# EAGLE design Rapid_Feeder_Master_RS485_small_v2 (EAGLE 9.6.2)
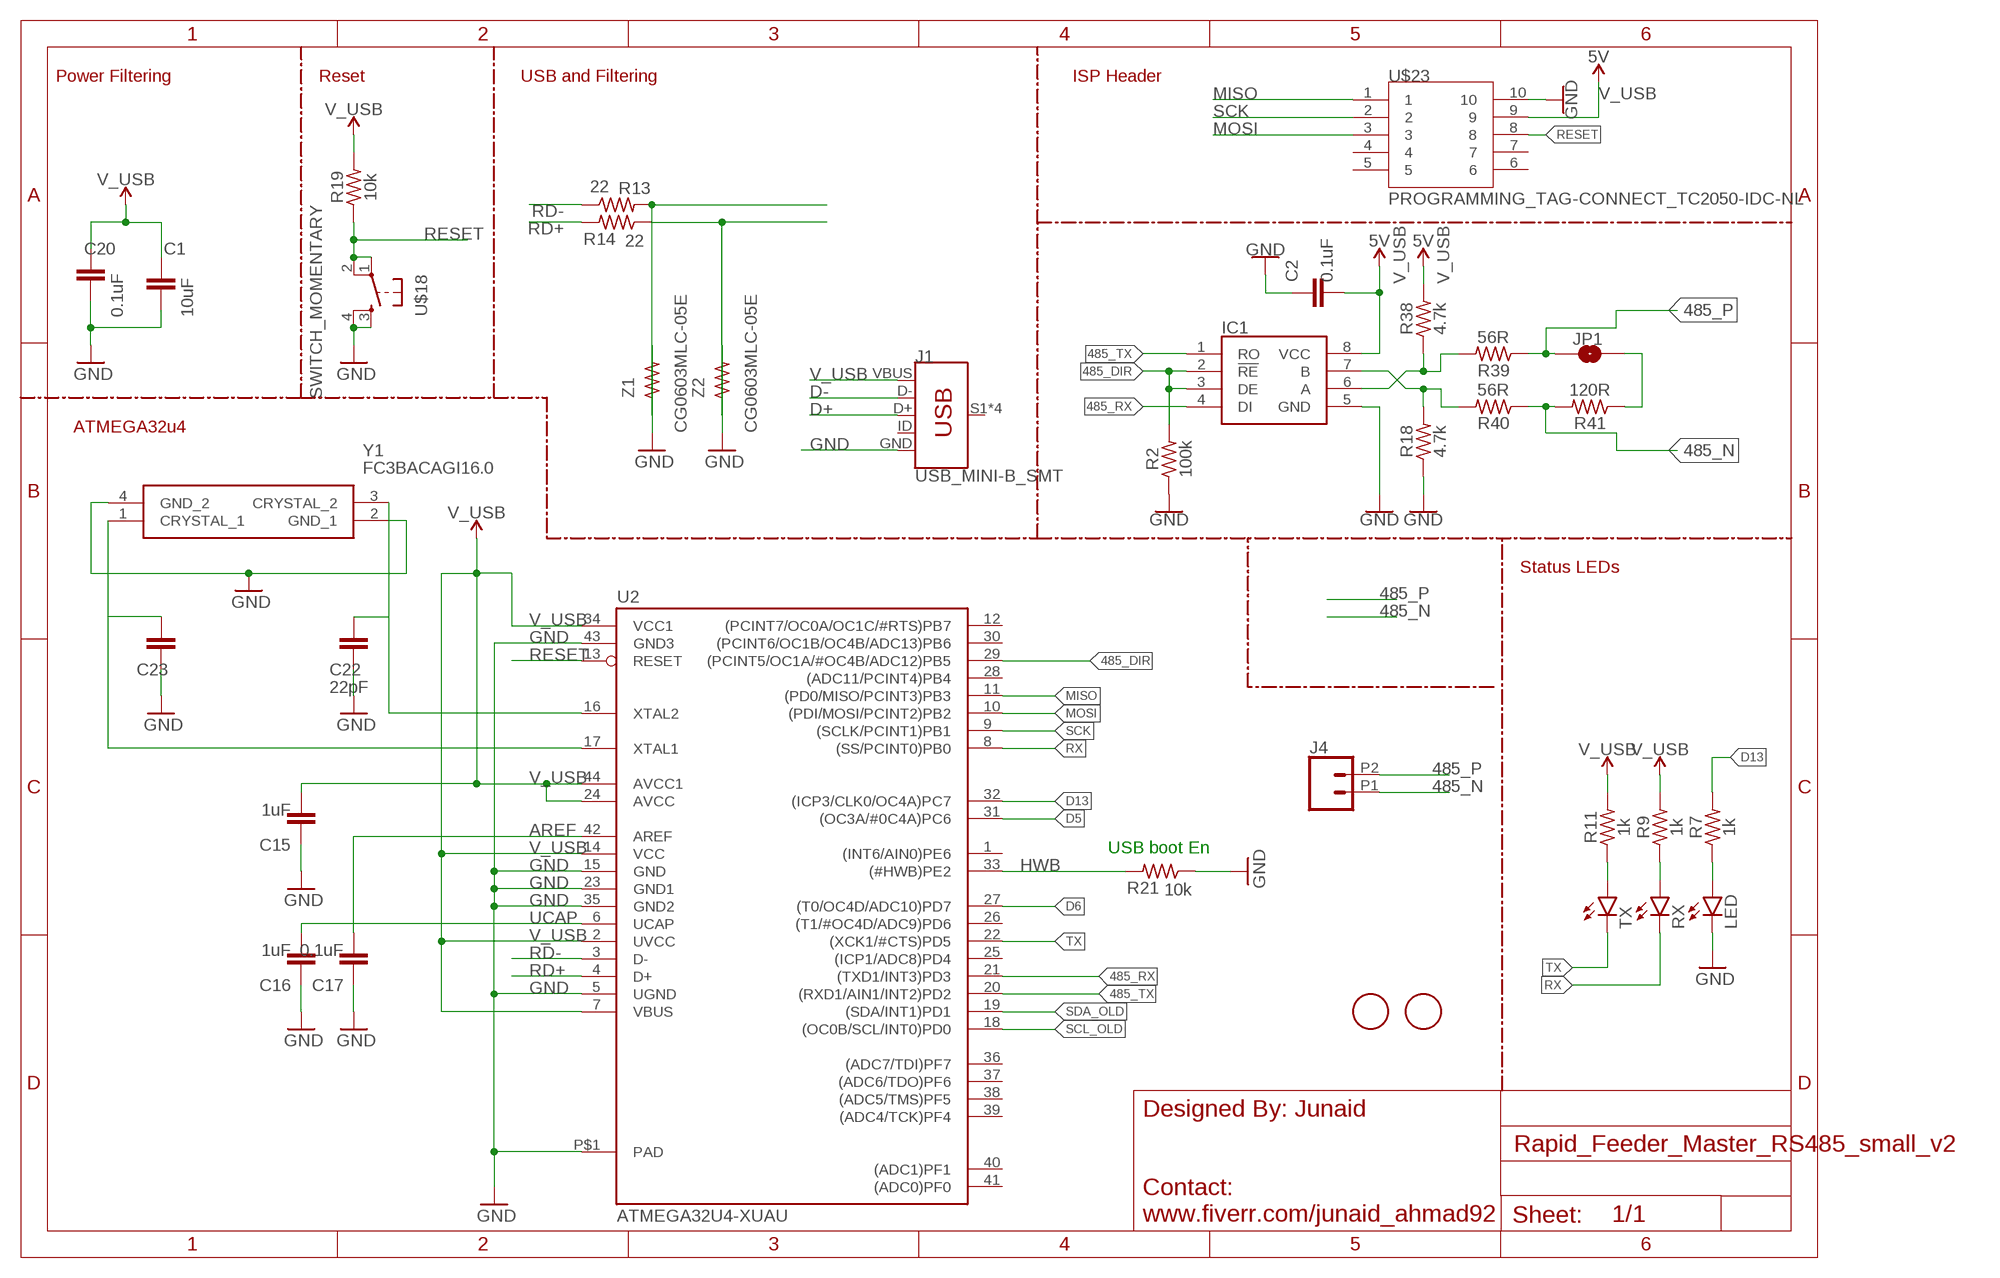
[diagram p0: schematic, sheet 1]

## Parts
C1  10uF  CAPACITORSC0805  [C0805]
C2  0.1uF  CAP_0603  [CAP_0603]
C15  1uF  CAP_0603  [CAP_0603]
C16  1uF  CAP_0603  [CAP_0603]
C17  0.1uF  CAP_0603  [CAP_0603]
C20  0.1uF  CAP_0603  [CAP_0603]
C22  22pF  CAP_0603  [CAP_0603]
C23  22pF  CAP_0603  [CAP_0603]
IC1  ADM4850ARZ-REEL7  [SOIC127P600X175-8N]
J1  USB_MINI-B_SMT  [USB-MINIB]
J4  CONN_022.54MM_SCREWTERM  [1X02_2.54_SCREWTERM]
JP1  JUMPER-SMT_2_NO_NO-SILK  [SMT-JUMPER_2_NO_NO-SILK]
LED  LED0603  [LED-0603]
R2  100k  RESISTOR_0603  [RESISTOR_0603]
R7  1k  RESISTOR_0603  [RESISTOR_0603]
R9  1k  RESISTOR_0603  [RESISTOR_0603]
R11  1k  RESISTOR_0603  [RESISTOR_0603]
R13  22  RESISTOR_0603  [RESISTOR_0603]
R14  22  RESISTOR_0603  [RESISTOR_0603]
R18  4.7k  RESISTOR_0603  [RESISTOR_0603]
R19  10k  RESISTOR_0603  [RESISTOR_0603]
R21  10k  RESISTOR_0603  [RESISTOR_0603]
R38  4.7k  RESISTOR_0603  [RESISTOR_0603]
R39  56R  RESISTOR_0603  [RESISTOR_0603]
R40  56R  RESISTOR_0603  [RESISTOR_0603]
R41  120R  RESISTOR_0603  [RESISTOR_0603]
RX  LED0603  [LED-0603]
TX  LED0603  [LED-0603]
U2  ATMEGA32U4-XUAU  [TQFP44-PAD]
U$1  FIDUCIAL  [FIDUCIAL_1MM]
U$2  FIDUCIAL  [FIDUCIAL_1MM]
U$18  SWITCH_MOMENTARY  [SWITCH_MOMENTARY]
U$23  PROGRAMMING_TAG-CONNECT_TC2050-IDC-NL  [PROGRAMMING_TAG-CONNECT_TC2050-IDC-NL]
Y1  FC3BACAGI16.0  [FC3BACAGI160]
Z1  CG0603MLC-05E  RESISTOR_0603  [RESISTOR_0603]
Z2  CG0603MLC-05E  RESISTOR_0603  [RESISTOR_0603]

## Nets
485_DIR: IC1.2(!RE) IC1.3(DE) R2.2 U2.29((PCINT5/OC1A/#OC4B/ADC12)PB5)
485_N: J4.P1 R40.1 R41.2
485_P: J4.P2 JP1.1 R39.1
485_RX: IC1.4(DI) U2.21((TXD1/INT3)PD3)
485_TX: IC1.1(RO) U2.20((RXD1/AIN1/INT2)PD2)
AREF [aref]: C17.2 U2.42(AREF)
D5: U2.31((OC3A/#0C4A)PC6)
D6: U2.27((T0/OC4D/ADC10)PD7)
D13: R7.2 U2.32((ICP3/CLK0/OC4A)PC7)
D+ [diff pairs]: J1.D+ R14.1 Z2.1
D- [diff pairs]: J1.D- R13.2 Z1.1
GND: C1.1 C2.1 C15.1 C16.1 C17.1 C20.1 C22.2 C23.2 IC1.5(GND) J1.GND LED.C R2.1 R18.1 R21.1 U2.5(UGND) U2.15(GND) U2.23(GND1) U2.35(GND2) U2.43(GND3) U2.P$1(PAD) U$18.3 U$18.4 U$23.10 Y1.2(GND_1) Y1.4(GND_2) Z1.2 Z2.2
HWB: R21.2 U2.33((#HWB)PE2)
MISO: U2.11((PD0/MISO/PCINT3)PB3) U$23.1
MOSI: U2.10((PDI/MOSI/PCINT2)PB2) U$23.3
N$10: R11.1 TX.A
N$18: IC1.6(A) R38.1 R39.2
N$19: IC1.7(B) R18.2 R40.2
N$20: JP1.2 R41.1
N$22: R9.1 RX.A
N$23: LED.A R7.1
RD+: R14.2 U2.4(D+)
RD-: R13.1 U2.3(D-)
RESET: R19.1 U2.13(RESET) U$18.1 U$18.2 U$23.8
RX: RX.C U2.8((SS/PCINT0)PB0)
SCK: U2.9((SCLK/PCINT1)PB1) U$23.2
SCL_OLD: U2.18((OC0B/SCL/INT0)PD0)
SDA_OLD: U2.19((SDA/INT1)PD1)
TX: TX.C U2.22((XCK1/#CTS)PD5)
UCAP: C16.2 U2.6(UCAP)
V_USB: C1.2 C2.2 C15.2 C20.2 IC1.8(VCC) J1.VBUS R9.2 R11.2 R19.2 R38.2 U2.2(UVCC) U2.7(VBUS) U2.14(VCC) U2.24(AVCC) U2.34(VCC1) U2.44(AVCC1) U$23.9 ; supply symbol labelled 5V
XTAL3: C22.1 U2.16(XTAL2) Y1.3(CRYSTAL_2)
XTAL4: C23.1 U2.17(XTAL1) Y1.1(CRYSTAL_1)
Unconnected: J1.ID J1.S1(SHIELD) J1.S2(SHIELD) J1.S3(SHIELD) J1.S4(SHIELD) U2.1((INT6/AIN0)PE6) U2.12((PCINT7/OC0A/OC1C/#RTS)PB7) U2.25((ICP1/ADC8)PD4) U2.26((T1/#OC4D/ADC9)PD6) U2.28((ADC11/PCINT4)PB4) U2.30((PCINT6/OC1B/OC4B/ADC13)PB6) U2.36((ADC7/TDI)PF7) U2.37((ADC6/TDO)PF6) U2.38((ADC5/TMS)PF5) U2.39((ADC4/TCK)PF4) U2.40((ADC1)PF1) U2.41((ADC0)PF0) U$23.4 U$23.5 U$23.6 U$23.7

## Notes on the sheet
- Power Filtering | Reset | USB and Filtering | ISP Header
- ATMEGA32u4
- Status LEDs
- USB boot En

## Library data of the parts
C1 = My-custom-components:CAPACITORS
C2 C15-C17 C20 C22 C23 = Shai-Parts:CAP_0603
IC1 = ADM4850ARZ-REEL7:ADM4850ARZ-REEL7: RS-422/RS-485 Interface IC 5V Slew-Rate Ltd Half Duplex 115kbps Source: Datasheet <https://www.analog.com/media/en/technical-documentation/data-sheets/ADM4850_4851_4852_4853_4854_4855_4856_4857.pdf>; DESCRIPTION: RS-422/RS-485 Interface IC 5V Slew-Rate Ltd Half Duplex 115kbps; HEIGHT: 1.75mm; MANUFACTURER_NAME: Analog Devices; MANUFACTURER_PART_NUMBER: ADM4850ARZ-REEL7; MOUSER_PART_NUMBER: 584-ADM4850ARZ-R7; MOUSER_PRICE-STOCK: https://www.mouser.com/Search/Refine.aspx?Keyword=584-ADM4850ARZ-R7
J1 = SparkFun-Connectors:USB_MINI-B: USB type Mini-B Connector Breaks out 5th pin, and includes shield pins if needed. SparkFun Products: SparkFun FTDI Basic Breakout <https://www.sparkfun.com/products/9716> SparkFun XBee Explorer USB <https://www.sparkfun.com/products/11812> SparkFun Redboard <https://www.sparkfun.com/products/12757>; PROD_ID: CONN-08193; SF_ID: PRT-00587
J4 = SparkFun-Connectors:CONN_02: Multi connection point. Often used as Generic Header-pin footprint for 0.1 inch spaced/style header connections On any of the 0.1 inch spaced packages, you can populate with these: Break Away Headers - Straight <https://www.sparkfun.com/products/116> (PRT-00116) Break Away Male Headers - Right Angle <https://www.sparkfun.com/products/553> (PRT-00553) Female Headers <https://www.sparkfun.com/products/115> (PRT-00115) Break Away Headers - Machine Pin <https://www.sparkfun.com/products/117> (PRT-00117) Break Away Female Headers - Swiss Machine Pin <https://www.sparkfun.com/products/743> (PRT-00743) For SCREWTERMINALS and SPRING TERMINALS visit here: Screw Terimnals on SparkFun.com <https://www.sparkfun.com/search/results?term=Screw+Terminals> (5mm/3.5mm/2.54mm spacing) This device is also useful as a general connection point to wire up your design to another part of your project. Our various solder wires solder well into these plated through hole pads. Hook-Up Wire - Assortment (Stranded, 22 AWG) <https://www.sparkfun.com/products/11375> (PRT-11375) Hook-Up Wire - Assortment (Solid Core, 22 AWG) <https://www.sparkfun.com/products/11367> (PRT-11367) View the entire wire category on our website here <https://www.sparkfun.com/categories/141> Special notes: Molex polarized connector foot print use with: PRT-08233 with associated crimp pins and housings. 2.54_SCREWTERM for use with PRT-10571. 3.5mm Screw Terminal footprints for PRT-08084 5mm Screw Terminal footprints for use with PRT-08432
JP1 = SparkFun-Jumpers:JUMPER-SMT_2_NO: Normally open jumper This jumper has two pads in close proximity to each other. Apply solder to close the connection. Round pads are easier to solder for beginners, but are a lot larger. SparkFun Product that uses the round pads: SparkFun EL Sequencer <https://www.sparkfun.com/products/12781>
LED RX TX = SparkFun-LED:LED: LED (Generic) Standard schematic elements and footprints for 5mm, 3mm, 1206, and 0603 sized LEDs. Generic LEDs with no color specified.
R2 R7 R9 R11 R13 R14 R18 R19 R21 R38-R41 Z1 Z2 = Shai-Parts:RESISTOR_0603
U2 = SmartPrj:ATMEGA32U4-XU
U$1 U$2 = adafruit:FIDUCIAL: For use by pick and place machines to calibrate the vision/machine, 1mm By microbuilder.eu
U$18 = Shai-Parts:SWITCH_MOMENTARY
U$23 = Shai-Parts:PROGRAMMING_TAG-CONNECT_TC2050-IDC-NL
Y1 = samacsys:FC3BACAGI16.0: Crystals 16MHz 12pF 30ppm -40C +125C Source: Datasheet <https://www.foxonline.com/wp-content/uploads/pdfs/C3BA.pdf>; ARROW_PART_NUMBER: FC3BACAGI16.0; DESCRIPTION: Crystals 16MHz 12pF 30ppm -40C +125C; HEIGHT: 0.8mm; MANUFACTURER_NAME: Fox; MANUFACTURER_PART_NUMBER: FC3BACAGI16.0; MOUSER_PART_NUMBER: 559-FC3BACAGI16.0; MOUSER_PRICE-STOCK: https://www.mouser.co.uk/ProductDetail/Fox/FC3BACAGI160?qs=W0yvOO0ixfHpyQil83gR7Q%3D%3D

## Net classes
1 diff pairs: width 0.203 mm, drill 0.35 mm, clearance 0.203 mm
4 aref: width 0.254 mm, drill 0.499 mm, clearance 0.254 mm

## Board
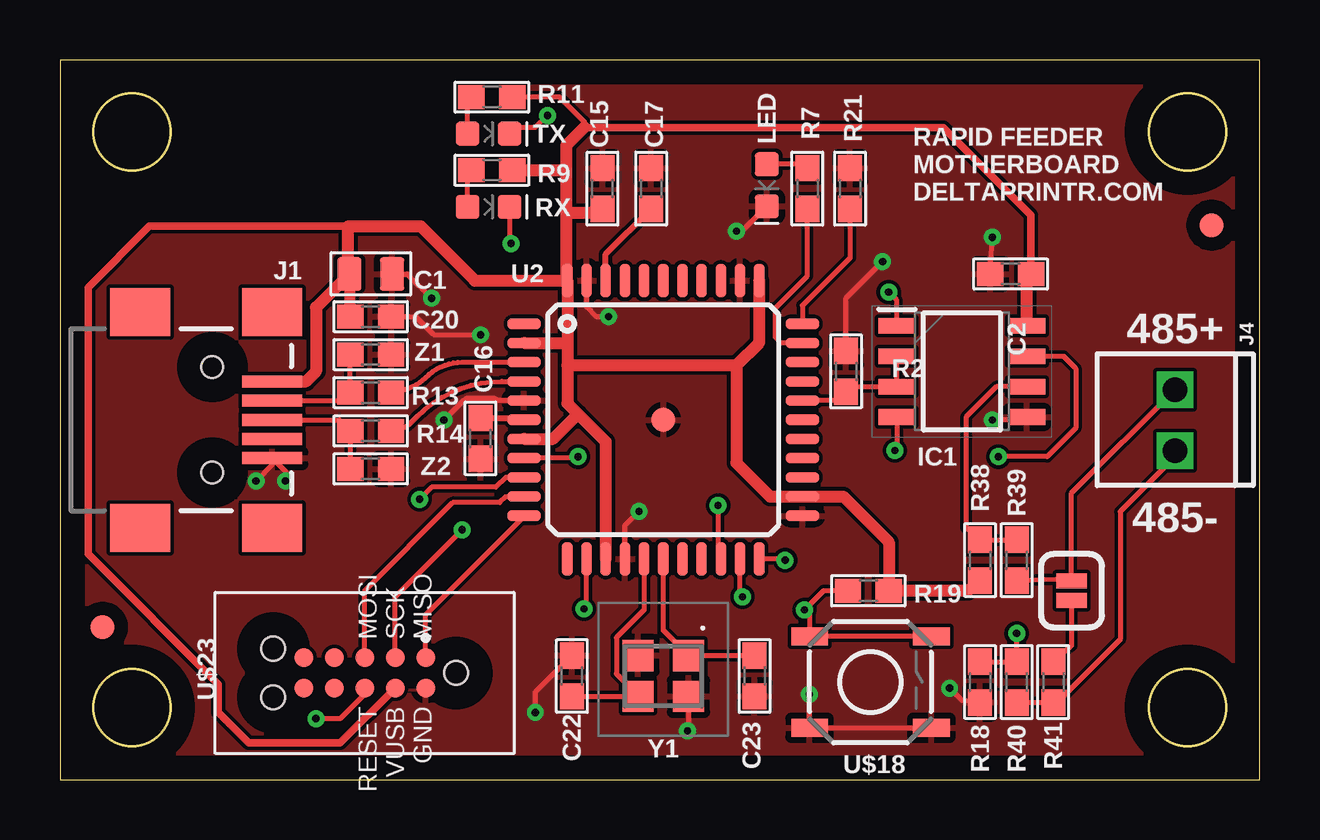
[diagram p1: board, top side]
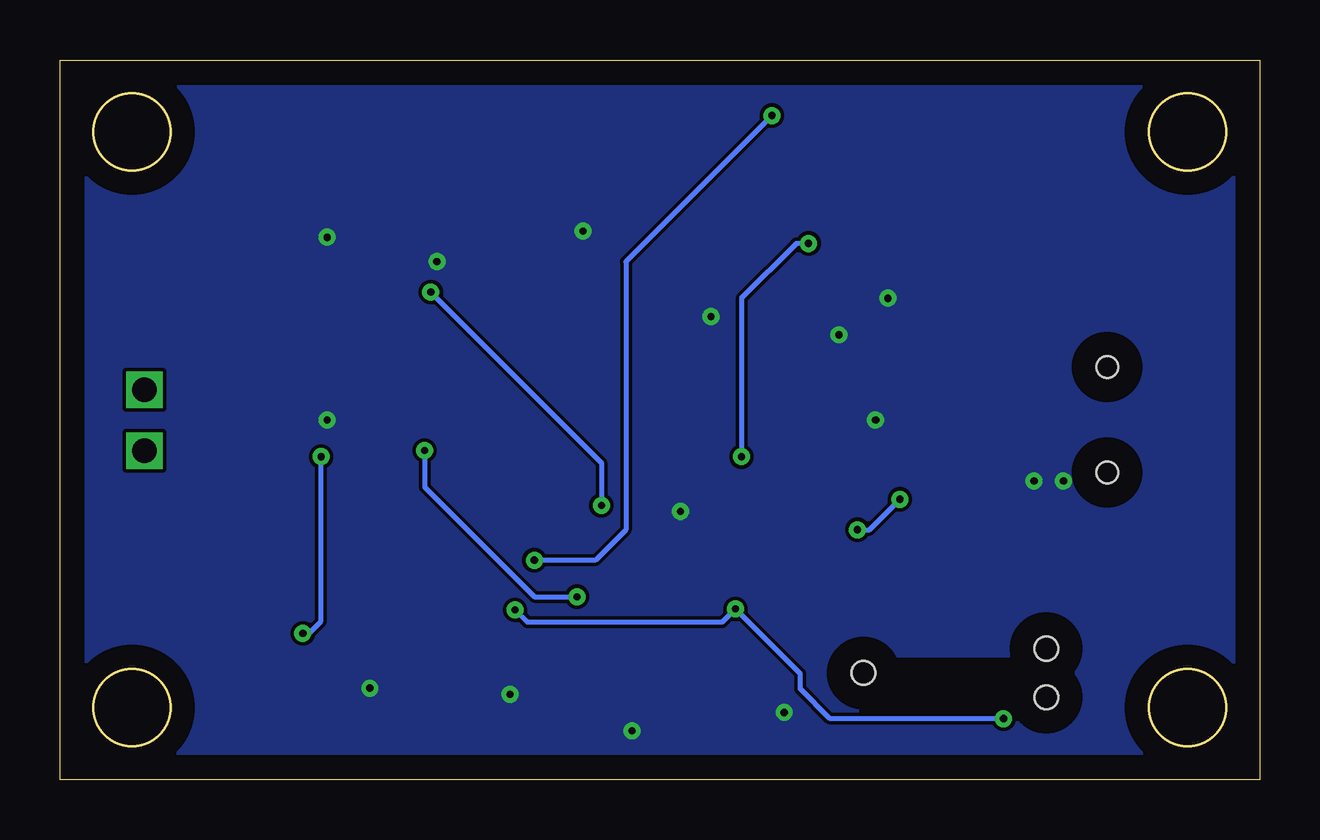
[diagram p2: board, bottom side, seen from below]

Size 50 x 30 mm. Coordinates in mm from the lower left corner, seen from the top.
Outline: 0,30 0,0 50,0 50,30 0,30
Outline: circle at 3,27 radius 1.6
Outline: circle at 47,27 radius 1.6
Outline: circle at 47,3 radius 1.6
Outline: circle at 3,3 radius 1.6
Copper layers (1*16): Top 0.035mm / dielectric 1.5mm / Bottom 0.035mm
Design rules "default *": minimum track width 6mil, minimum drill 0.3mm, track to track 6mil, track to pad 6mil, pad to pad 6mil, via to via 6mil, smd to smd 6mil, copper to edge 40mil, drill to drill 6mil, minimum pad ring 10mil, minimum via ring 8mil, stop-mask expansion 4mil, vias tented up to drill 0.3mm, thermal gap 10mil

### Footprints (pad centres in the part's own frame; a part is rotated, then mirrored left to right if it is on the bottom)
C0805 = smd 1.397 x 1.016: 1 0,0.889; 2 0,-0.889
CAP_0603 = smd 1.1 x 1: 1 -0.85,0; 2 0.85,0
SOIC127P600X175-8N = smd 1.525 x 0.65: 1 -2.712,1.905; 2 -2.712,0.635; 3 -2.712,-0.635; 4 -2.712,-1.905; 5 2.712,-1.905; 6 2.712,-0.635; 7 2.712,0.635; 8 2.712,1.905
USB-MINIB = smd 2.5 x 0.5: D+ 2.5,0; D- 2.5,0.8; GND 2.5,-1.6; ID 2.5,-0.8; VBUS 2.5,1.6 | smd 2.5 x 2: S1 -3,4.5; S2 2.5,4.5; S3 -3,-4.5; S4 2.5,-4.5 | hole 0.9: 0,2.2; 0,-2.2
1X02_2.54_SCREWTERM = drill 1.016 square: P1 2.54,0; P2 0,0
SMT-JUMPER_2_NO_NO-SILK = smd 0.635 x 1.27: 1 -0.406,0; 2 0.406,0
LED-0603 = smd 1 x 1: A -0.877,0; C 0.877,0
RESISTOR_0603 = smd 1.1 x 1: 1 -0.85,0; 2 0.85,0
TQFP44-PAD = smd 1.4 x 0.45: 1 -5.8,4; 2 -5.8,3.2; 3 -5.8,2.4; 4 -5.8,1.6; 5 -5.8,0.8; 6 -5.8,0; 7 -5.8,-0.8; 8 -5.8,-1.6; 9 -5.8,-2.4; 10 -5.8,-3.2; 11 -5.8,-4; 23 5.8,-4; 24 5.8,-3.2; 25 5.8,-2.4; 26 5.8,-1.6; 27 5.8,-0.8; 28 5.8,0; 29 5.8,0.8; 30 5.8,1.6; 31 5.8,2.4; 32 5.8,3.2; 33 5.8,4 | smd 0.45 x 1.4: 12 -4,-5.8; 13 -3.2,-5.8; 14 -2.4,-5.8; 15 -1.6,-5.8; 16 -0.8,-5.8; 17 0,-5.8; 18 0.8,-5.8; 19 1.6,-5.8; 20 2.4,-5.8; 21 3.2,-5.8; 22 4,-5.8; 34 4,5.8; 35 3.2,5.8; 36 2.4,5.8; 37 1.6,5.8; 38 0.8,5.8; 39 0,5.8; 40 -0.8,5.8; 41 -1.6,5.8; 42 -2.4,5.8; 43 -3.2,5.8; 44 -4,5.8 | smd 1 x 1: P$1 0,0
FIDUCIAL_1MM = smd 1 x 1: 1 0,0
SWITCH_MOMENTARY = smd 1.524 x 0.762: 1 -2.54,1.905; 2 2.54,1.905; 3 -2.54,-1.905; 4 2.54,-1.905
PROGRAMMING_TAG-CONNECT_TC2050-IDC-NL = smd 0.787 x 0.787: 1 1.27,7.62; 2 1.27,6.35; 3 1.27,5.08; 4 1.27,3.81; 5 1.27,2.54; 6 2.54,2.54; 7 2.54,3.81; 8 2.54,5.08; 9 2.54,6.35; 10 2.54,7.62 | hole 0.991: 2.92,1.27; 0.89,1.27; 1.905,8.89
FC3BACAGI160 = smd 1.3 x 1.3: 1 -1.05,-0.85; 2 1.05,-0.85; 3 1.05,0.85; 4 -1.05,0.85

### Placement (x,y rotation side)
C1  12.95,21.08 270 top
C2  39.62,21.08 0 top
C15  22.61,24.64 270 top
C16  17.53,14.22 90 top
C17  24.64,24.64 270 top
C20  12.95,19.3 180 top
C22  21.34,4.32 90 top
C23  28.96,4.32 270 top
IC1  37.59,17.02 0 top
J1  6.35,15 0 top
J4  46.48,16.26 270 top
JP1  42.16,7.87 270 top
LED  29.46,24.77 270 top
R2  32.77,17.02 270 top
R7  31.15,24.64 270 top
R9  18,25.4 0 top
R11  18,28.45 0 top
R13  12.95,16.13 180 top
R14  12.95,14.54 0 top
R18  38.35,4.06 90 top
R19  33.69,7.87 0 top
R21  32.93,24.64 270 top
R38  38.35,9.14 270 top
R39  39.88,9.14 90 top
R40  39.88,4.06 90 top
R41  41.4,4.06 270 top
RX  17.87,23.88 0 top
TX  17.87,26.92 0 top
U2  25.15,15 0 top
U$1  48.01,23.11 0 top
U$2  1.78,6.35 0 top
U$18  33.78,4.06 0 top
U$23  7.62,6.35 270 top
Y1  25.15,4.32 180 top
Z1  12.95,17.71 0 top
Z2  12.95,12.95 0 top

### Tracks (layer width: path | path; a pad name or v marks a point on that pad's centre or on a via)
485_DIR
  Top 0.203: U2.29 32.31,15.8 R2.2 32.89,16.38 IC1.3 IC1.2
485_N
  Top 0.203: R40.1 R41.2 41.66,3.3 44.2,5.84 44.2,11.18 46.48,13.46 J4.P1
485_P
  Top 0.203: R39.1 42.06,8.38 JP1.1 42.16,11.94 J4.P2
485_RX  (via drill 0.3)
  Top 0.203: IC1.4 34.88,13.8 v34.8,13.72 | v28.45,7.62 28.35,7.72 U2.21
  Bottom 0.203: v34.8,13.72 34.8,12.19 30.23,7.62 v28.45,7.62
485_TX  (via drill 0.3)
  Top 0.203: IC1.1 34.88,19.98 v34.54,20.32 | v27.43,11.43 27.43,9.31 U2.20
  Bottom 0.203: v34.54,20.32 27.43,13.21 v27.43,11.43
AREF
  Top 0.254: U2.42 22.75,21.9 C17.2
D13
  Top 0.203: U2.32 30.06,18.2 29.82,18.44 29.82,19.66 31.15,20.99 R7.2
D+
  Top 0.203: J1.D+ 11.64,15 R14.1 Z2.1
D-
  Top 0.203: J1.D- 11.78,15.8 R13.2 Z1.1
GND  (via drill 0.3)
  Top 0.203: v8.17,12.45 8.85,13.13 J1.GND 9.4,12.85 v9.4,12.45 | C1.1 14.48,21.08 v15.49,20.07 | C20.1 14.82,19.3 15.58,18.54 v17.53,18.54 | U2.15 23.55,10.59 v24.13,11.18 | v16,14.99 16.82,15.8 16.84,15.8 16.92,15.88 18.13,15.88 18.21,15.8 U2.5 | U2.43 21.95,19.71 22.35,19.3 v22.86,19.3 | LED.C 28.43,22.86 v28.19,22.86 | R2.1 32.77,20.07 v34.29,21.59 | IC1.5 40.18,14.99 v38.86,14.99 | C2.1 v38.86,22.61 | U$18.4 U$18.3 v31.24,3.56 | Y1.4 26.2,2.07 v26.16,2.03 | C22.2 19.81,3.64 v19.81,2.79 | R18.1 37.59,3.3 v37.08,3.81
  pour Bottom: -2.54,32.51 52.83,32.51 52.83,-2.54 -2.54,-2.54
  pour Top: -5.08,35.05 55.12,35.05 55.12,-5.59 -5.08,-5.59
HWB
  Top 0.203: R21.2 32.93,21.75 30.95,19.76 U2.33
MISO
  Top 0.203: U$23.1 15.24,6.86 19.35,10.96 U2.11
MOSI
  Top 0.203: U$23.3 12.7,7.87 16.37,11.55 18.33,11.55 18.58,11.8 U2.10
N$10
  Top 0.203: TX.A 16.99,28.28 R11.1
N$18
  Top 0.203: R39.2 R38.1 37.76,10.5 37.76,15.11 39.03,16.38 IC1.6
N$19  (via drill 0.3)
  Top 0.203: R18.2 R40.2 v39.88,6.1 | IC1.7 41.83,17.65 42.34,17.14 42.34,14.65 41.15,13.46 v39.12,13.46
  Bottom 0.203: v39.88,6.1 39.62,6.1 39.12,6.6 v39.12,13.46
N$20
  Top 0.203: R41.1 42.16,5.59 JP1.2
N$22
  Top 0.203: RX.A 16.99,25.24 R9.1
N$23
  Top 0.203: R7.1 30.99,25.65 LED.A
RD+
  Top 0.203: R14.2 arc45 14.63,14.88 14.88,15.14 arc-45 18.41,16.6 U2.4
RD-
  Top 0.203: R13.1 13.88,16.2 arc45 15.24,16.76 arc-45 16.77,17.4 U2.3
RESET  (via drill 0.3)
  Top 0.203: U$23.8 12.7,3.56 11.68,2.54 v10.67,2.54 | v21.84,7.11 21.95,7.21 U2.13 | R19.1 31.83,7.87 v31.03,7.07 31.24,6.86 U$18.1 U$18.2
  Bottom 0.203: v10.67,2.54 17.9,2.54 19.14,3.78 19.14,4.41 v21.84,7.11 22.39,6.57 30.52,6.57 v31.03,7.07
RX  (via drill 0.3)
  Top 0.203: RX.C 18.74,22.41 v18.8,22.35 | v21.59,13.46 21.53,13.4 U2.8
  Bottom 0.203: v18.8,22.35 19.3,22.35 21.59,20.07 v21.59,13.46
SCK  (via drill 0.3)
  Top 0.203: U$23.2 13.97,7.62 v16.76,10.41 | U2.9 18.58,12.6 18.18,12.19 15.49,12.19 v14.99,11.68
  Bottom 0.203: v14.99,11.68 16.26,10.41 v16.76,10.41
TX  (via drill 0.3)
  Top 0.203: v20.32,27.69 19.81,27.18 19,27.18 TX.C | v30.23,9.14 30.17,9.2 U2.22
  Bottom 0.203: v20.32,27.69 26.42,21.59 26.42,10.41 27.69,9.14 v30.23,9.14
UCAP
  Top 0.254: C16.2 19.27,15.07 U2.6
V_USB
  Top 0.203: 21.84,27.18 21.84,27.43 20.83,28.45 R11.2
  Top 0.305: U$23.9 11.68,1.52 7.87,1.52 6.6,2.79 6.6,3.96 1.17,9.4 1.17,20.51 3.72,23.06 12.01,23.06 | C2.2 40.47,23.53 36.83,27.18 21.84,27.18
  Top 0.457: C20.2 12.1,21.04 C1.2
  Top 0.508: 28.19,17.27 28.19,13.21 29.6,11.8 U2.24 32.65,11.8 34.54,9.91 R19.2 37.85,7.87 R38.2 | U2.14 22.75,14.08 21.59,15.24 | C2.2 40.3,20.8 IC1.8 | J1.VBUS 10.25,16.6 10.67,17.02 10.67,19.68 C1.2 12.01,21.13 12.01,23.06 15.04,23.06 17.3,20.8 U2.44 | U2.44 21.11,20.84 21.11,23.62 | 21.11,23.62 21.11,25.4 | 21.11,25.4 21.11,26.45 21.84,27.18 | C15.2 22.44,23.62 21.11,23.62 | R9.2 21.11,25.4 | U2.44 21.15,18.29 | 21.15,18.29 21.15,17.27 | 21.15,17.27 21.15,15.68 21.59,15.24 | U2.7 20.55,14.2 21.59,15.24 | U2.2 21.06,18.2 21.15,18.29 | 21.15,17.27 28.19,17.27 | 28.19,17.27 29.15,18.22 U2.34
XTAL3
  Top 0.203: C22.1 Y1.3 24.1,3.51 23.19,4.41 23.19,5.92 24.35,7.08 U2.16
XTAL4
  Top 0.203: C23.1 Y1.1 25.15,6.22 U2.17

### Text on the board
tPlace: RAPID FEEDER / MOTHERBOARD / DELTAPRINTR.COM | 485+ | 485- | MOSI / SCK / MISO | RESET / VUSB / GND